# EAGLE design Esquematico (EAGLE 7.1.0)
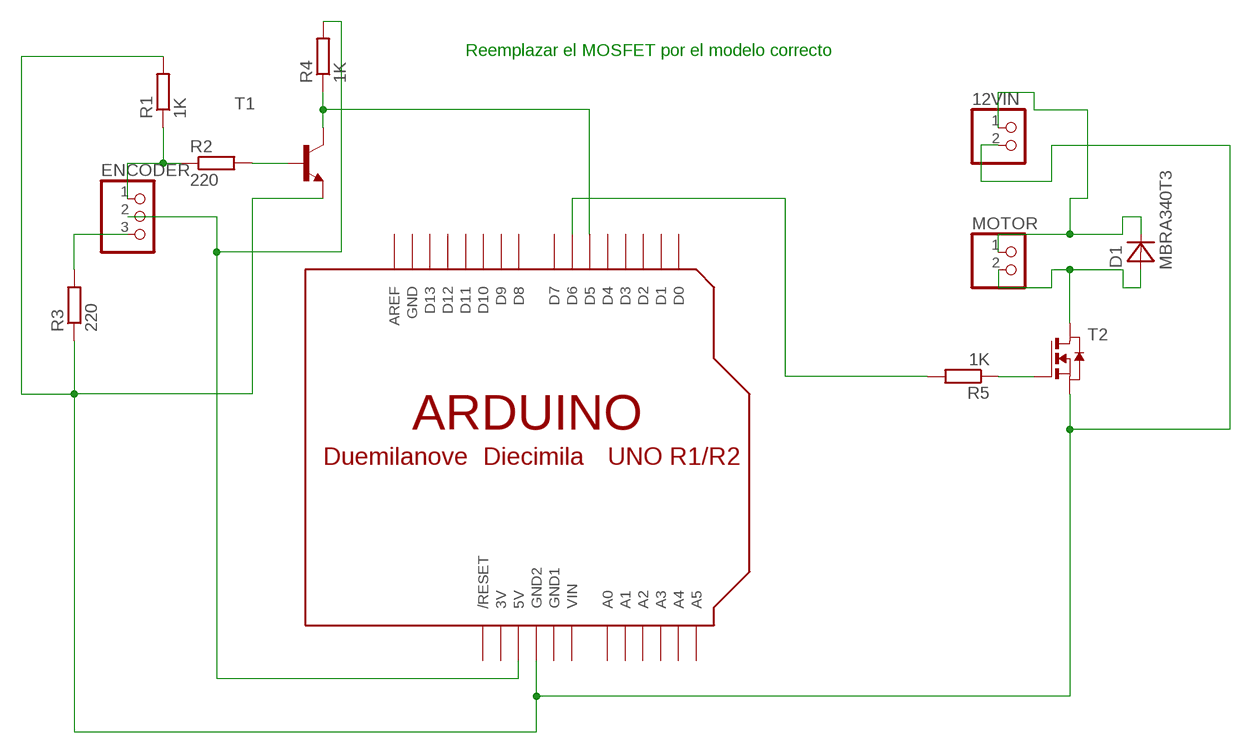
[diagram p0: schematic, sheet 1]

## Parts
12VIN  PINHD-1X2  [1X02]
D1  MBRA340T3  [SMA]
ENCODER  PINHD-1X3CB  [1X03-CLEANBIG]
MOTOR  PINHD-1X2  [1X02]
R1  1K  R-EU_R1206  [R1206]
R2  220  R-EU_R1206  [R1206]
R3  220  R-EU_R1206  [R1206]
R4  1K  R-EU_R1206  [R1206]
R5  1K  R-EU_R1206  [R1206]
T1  BC817-40LT1-NPN-SOT23-BEC  [SOT23-BEC]
T2  NMOSSOT223  [SOT223]
U$1  ARDUINO-NOHOLE  [ARDUINO-NOHOLE]

## Nets
N$1: ENCODER.3 R3.2
N$2: 12VIN.2 R1.2 R3.1 T1.E T2.3(S) U$1.GND2
N$3: ENCODER.2 R4.2 U$1.5V
N$4: ENCODER.1 R1.1 R2.1
N$5: R5.1 T2.1(G)
N$6: R2.2 T1.B
N$9: D1.A MOTOR.2 T2.2(D) T2.4(D)
N$10: 12VIN.1 D1.C MOTOR.1
N$11: R5.2 U$1.D6
N$12: R4.1 T1.C U$1.D5
Unconnected: U$1.A0 U$1.A1 U$1.A2 U$1.A3 U$1.A4 U$1.A5 U$1.AREF U$1.D0 U$1.D1 U$1.D2 U$1.D3 U$1.D4 U$1.D7 U$1.D8 U$1.D9 U$1.D10 U$1.D11 U$1.D12 U$1.D13 U$1.RESET(/RESET)

## Notes on the sheet
- Reemplazar el MOSFET por el modelo correcto

## Power pins joined to a net without a drawn wire
3V: U$1.3V
GND: U$1.GND
GND1: U$1.GND1
VIN: U$1.VIN

## Library data of the parts
12VIN MOTOR = pinhead:PINHD-1X2: PIN HEADER
D1 = diode:MBRA340T3: Surface Mount Schottky Power Rectifier Source: http://www.onsemi.com/pub_link/Collateral/MBRA340T3-D.PDF
ENCODER = adafruit:PINHD-1X3: PIN HEADER
R1-R5 = rcl:R-EU_: RESISTOR, European symbol
T1 = transistor:*-NPN-: NPN Transistror BF959 corrected 2008.03.06
T2 = zetex:NMOSSOT223: MOS FET; OC_FARNELL: unknown; OC_NEWARK: unknown
U$1 = adafruit:ARDUINO: Arduino Diecimila/Duemilanove Make a shield with ease, this package has all the named pins as well as the two mounting drill holes and an outline of the USB and DC power connector. The outline is on the DIMENSION layer, so if your board house uses it they will cut the outline to match. http://www.ladyada.net/library/pcb/eaglelibrary.html

## Board
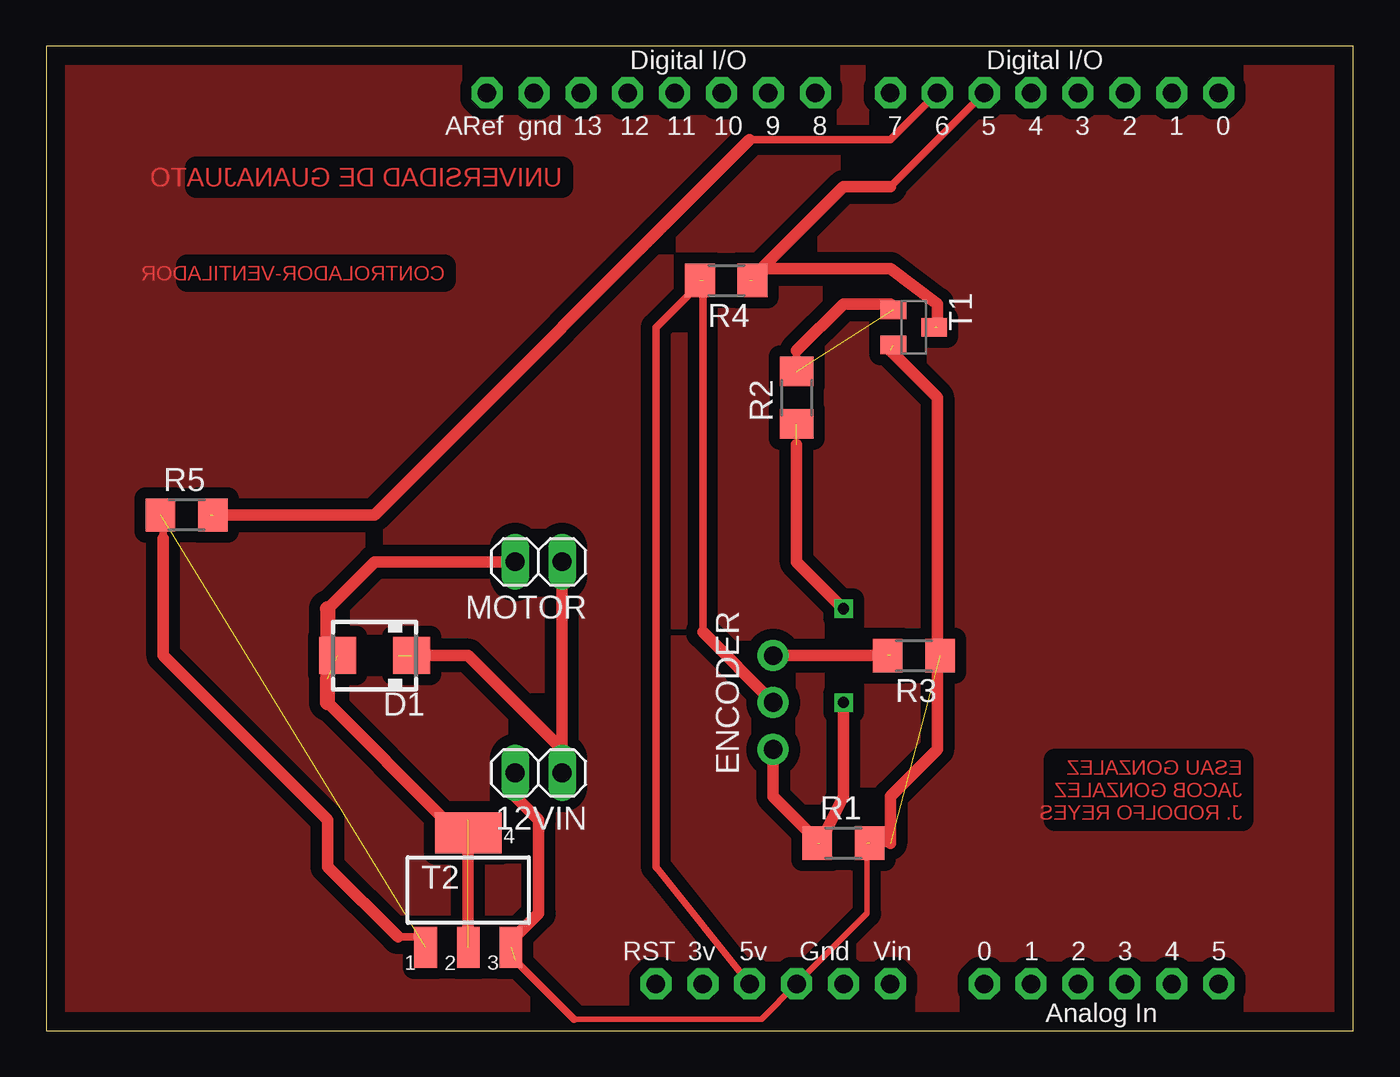
[diagram p1: board, top side]
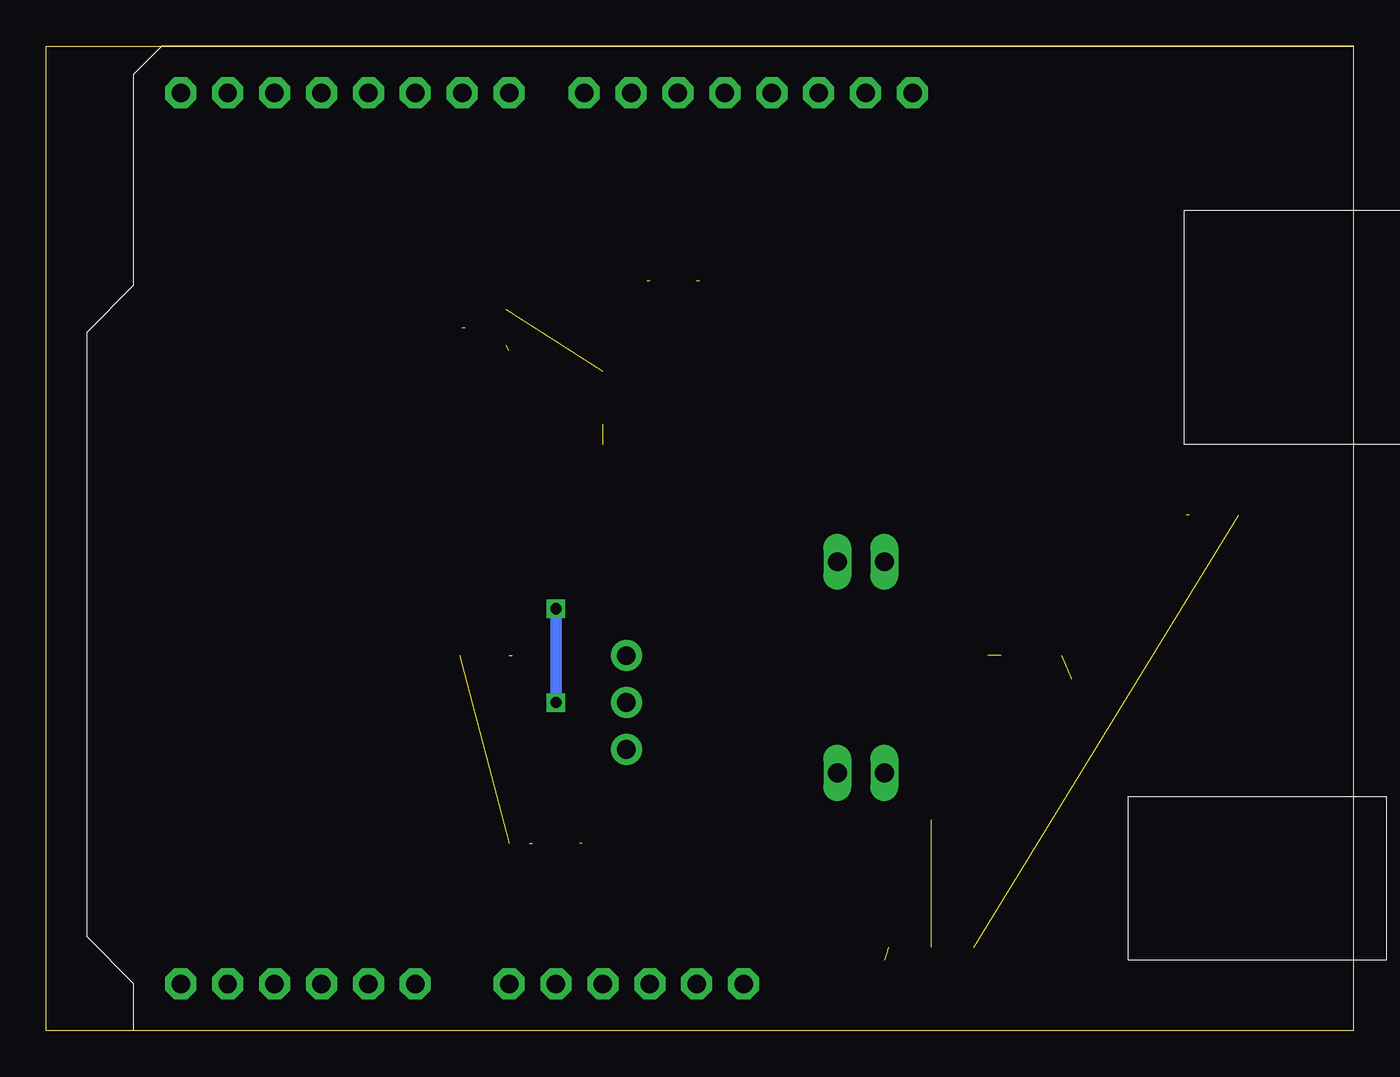
[diagram p2: board, bottom side, seen from below]

Size 70.79 x 53.33 mm. Coordinates in mm from the lower left corner, seen from the top.
Outline: 0,0 70.79,0 70.79,53.33 0,53.33 0,0
Copper layers (1*16): Top 0.035mm / dielectric 1.5mm / Bottom 0.035mm
Design rules "default": minimum track width 10mil, minimum drill 24mil, track to track 8mil, track to pad 8mil, pad to pad 8mil, via to via 8mil, smd to smd 8mil, copper to edge 40mil, drill to drill 8mil, minimum pad ring 10mil, minimum via ring 8mil, stop-mask expansion 4mil, vias tented up to drill 0mil, thermal gap 10mil

### Footprints (pad centres in the part's own frame; a part is rotated, then mirrored left to right if it is on the bottom)
1X02 = drill 1.016 long: 1 -1.27,0; 2 1.27,0
SMA = smd 2 x 2: A 2,0; C -2,0
1X03-CLEANBIG = drill 1.016 pad 1.676: 1 -2.54,0; 2 0,0; 3 2.54,0
R1206 = smd 1.6 x 1.803: 1 -1.422,0; 2 1.422,0
SOT23-BEC = smd 1 x 1.4: B -0.95,-1.1; C 0,1.1; E 0.95,-1.1
SOT223 = smd 1.219 x 2.235: 1 -2.311,-3.099; 2 0,-3.099; 3 2.311,-3.099 | smd 3.6 x 2.2: 4 0,3.099
ARDUINO-NOHOLE = drill 1 pad 1.676 octagon: 3V 35.56,2.54; 5V 38.1,2.54; A0 50.8,2.54; A1 53.34,2.54; A2 55.88,2.54; A3 58.42,2.54; A4 60.96,2.54; A5 63.5,2.54; AREF 23.876,50.8; D0 63.5,50.8; D1 60.96,50.8; D2 58.42,50.8; D3 55.88,50.8; D4 53.34,50.8; D5 50.8,50.8; D6 48.26,50.8; D7 45.72,50.8; D8 41.656,50.8; D9 39.116,50.8; D10 36.576,50.8; D11 34.036,50.8; D12 31.496,50.8; D13 28.956,50.8; GND 26.416,50.8; GND1 43.18,2.54; GND2 40.64,2.54; RESET 33.02,2.54; VIN 45.72,2.54

### Placement (x,y rotation side)
12VIN  26.67,13.97 180 top
D1  17.78,20.32 180 top
ENCODER  39.37,17.78 90 top
MOTOR  26.67,25.4 180 top
R1  43.18,10.16 0 top
R2  40.64,34.29 90 top
R3  46.99,20.32 180 top
R4  36.83,40.64 180 top
R5  7.62,27.94 0 top
T1  46.99,38.1 270 top
T2  22.86,7.62 0 top
U$1  0,0 0 top

### Tracks (layer width: path | path; a pad name or v marks a point on that pad's centre or on a via)
N$1  (1 unrouted)
  Top 0.61: ENCODER.3 45.72,20.32
N$2  (4 unrouted)
  Top 0.305: 28.57,0.64 38.73,0.64 U$1.GND2 44.45,6.35 44.45,10.16
  Top 0.406: 25.4,3.81 28.57,0.64 | 44.45,10.16 45.72,10.16
  Top 0.61: 25.4,3.81 25.4,5.08 26.67,6.35 26.67,11.43 25.4,12.7 12VIN.2 | 45.72,36.83 48.26,34.29 48.26,15.24 45.72,12.7 45.72,10.16
N$3  (1 unrouted)
  Top 0.406: U$1.5V 33.02,8.89 33.02,38.1 35.56,40.64 35.56,21.59
  Top 0.61: ENCODER.2 35.56,21.59
N$4  (via drill 0.6)  (2 unrouted)
  Top 0.61: ENCODER.1 39.37,12.7 41.91,10.16 43.18,12.7 v43.18,17.78 | v43.18,22.86 40.64,25.4 40.64,31.75
  Bottom 0.61: v43.18,17.78 v43.18,22.86
N$5  (1 unrouted)
N$6  (1 unrouted)
N$7
  Top 0.406: 20.32,5.08 19.05,5.08 | 6.35,26.67 6.35,27.94
  Top 0.61: 19.05,5.08 15.24,8.89 15.24,11.43 6.35,20.32 6.35,26.67
N$9  (3 unrouted)
  Top 0.406: 22.86,11.43 21.59,11.43
  Top 0.61: 21.59,11.43 15.24,17.78 | MOTOR.2 17.78,25.4 15.24,22.86
  Top 0.813: 15.24,17.78 15.24,19.05 15.24,22.86
N$10  (1 unrouted)
  Top 0.406: 12VIN.1 27.94,15.24 | 20.32,20.32 19.05,20.32
  Top 0.61: 12VIN.1 MOTOR.1 | 27.94,15.24 22.86,20.32 20.32,20.32
N$11  (1 unrouted)
  Top 0.406: 38.1,48.26 45.72,48.26 U$1.D6
  Top 0.61: 8.89,27.94 17.78,27.94 38.1,48.26
N$12  (2 unrouted)
  Top 0.406: 45.72,45.72 U$1.D5
  Top 0.61: 38.73,41.27 43.18,45.72 45.72,45.72 | 38.1,40.64 38.73,41.27 | 38.73,41.27 45.72,41.27 48.26,39.37 48.26,38.1
N$13
  Top 0.61: 22.86,3.81 22.86,10.16
N$14
  Top 0.406: 40.64,35.56 40.64,36.83
  Top 0.61: 40.64,36.83 43.18,39.37 45.72,39.37
N$19
  pour Top (isolate 0.61): 0,53.34 68.58,53.34 69.85,52.07 69.85,1.27 68.58,0 0,0

### Text on the board
Top: UNIVERSIDAD DE GUANAJUATO | CONTROLADOR-VENTILADOR | ESAU GONZALEZ / JACOB GONZALEZ / J. RODOLFO REYES